# EAGLE schematic double_bellows_configuration (EAGLE 9.6.2)
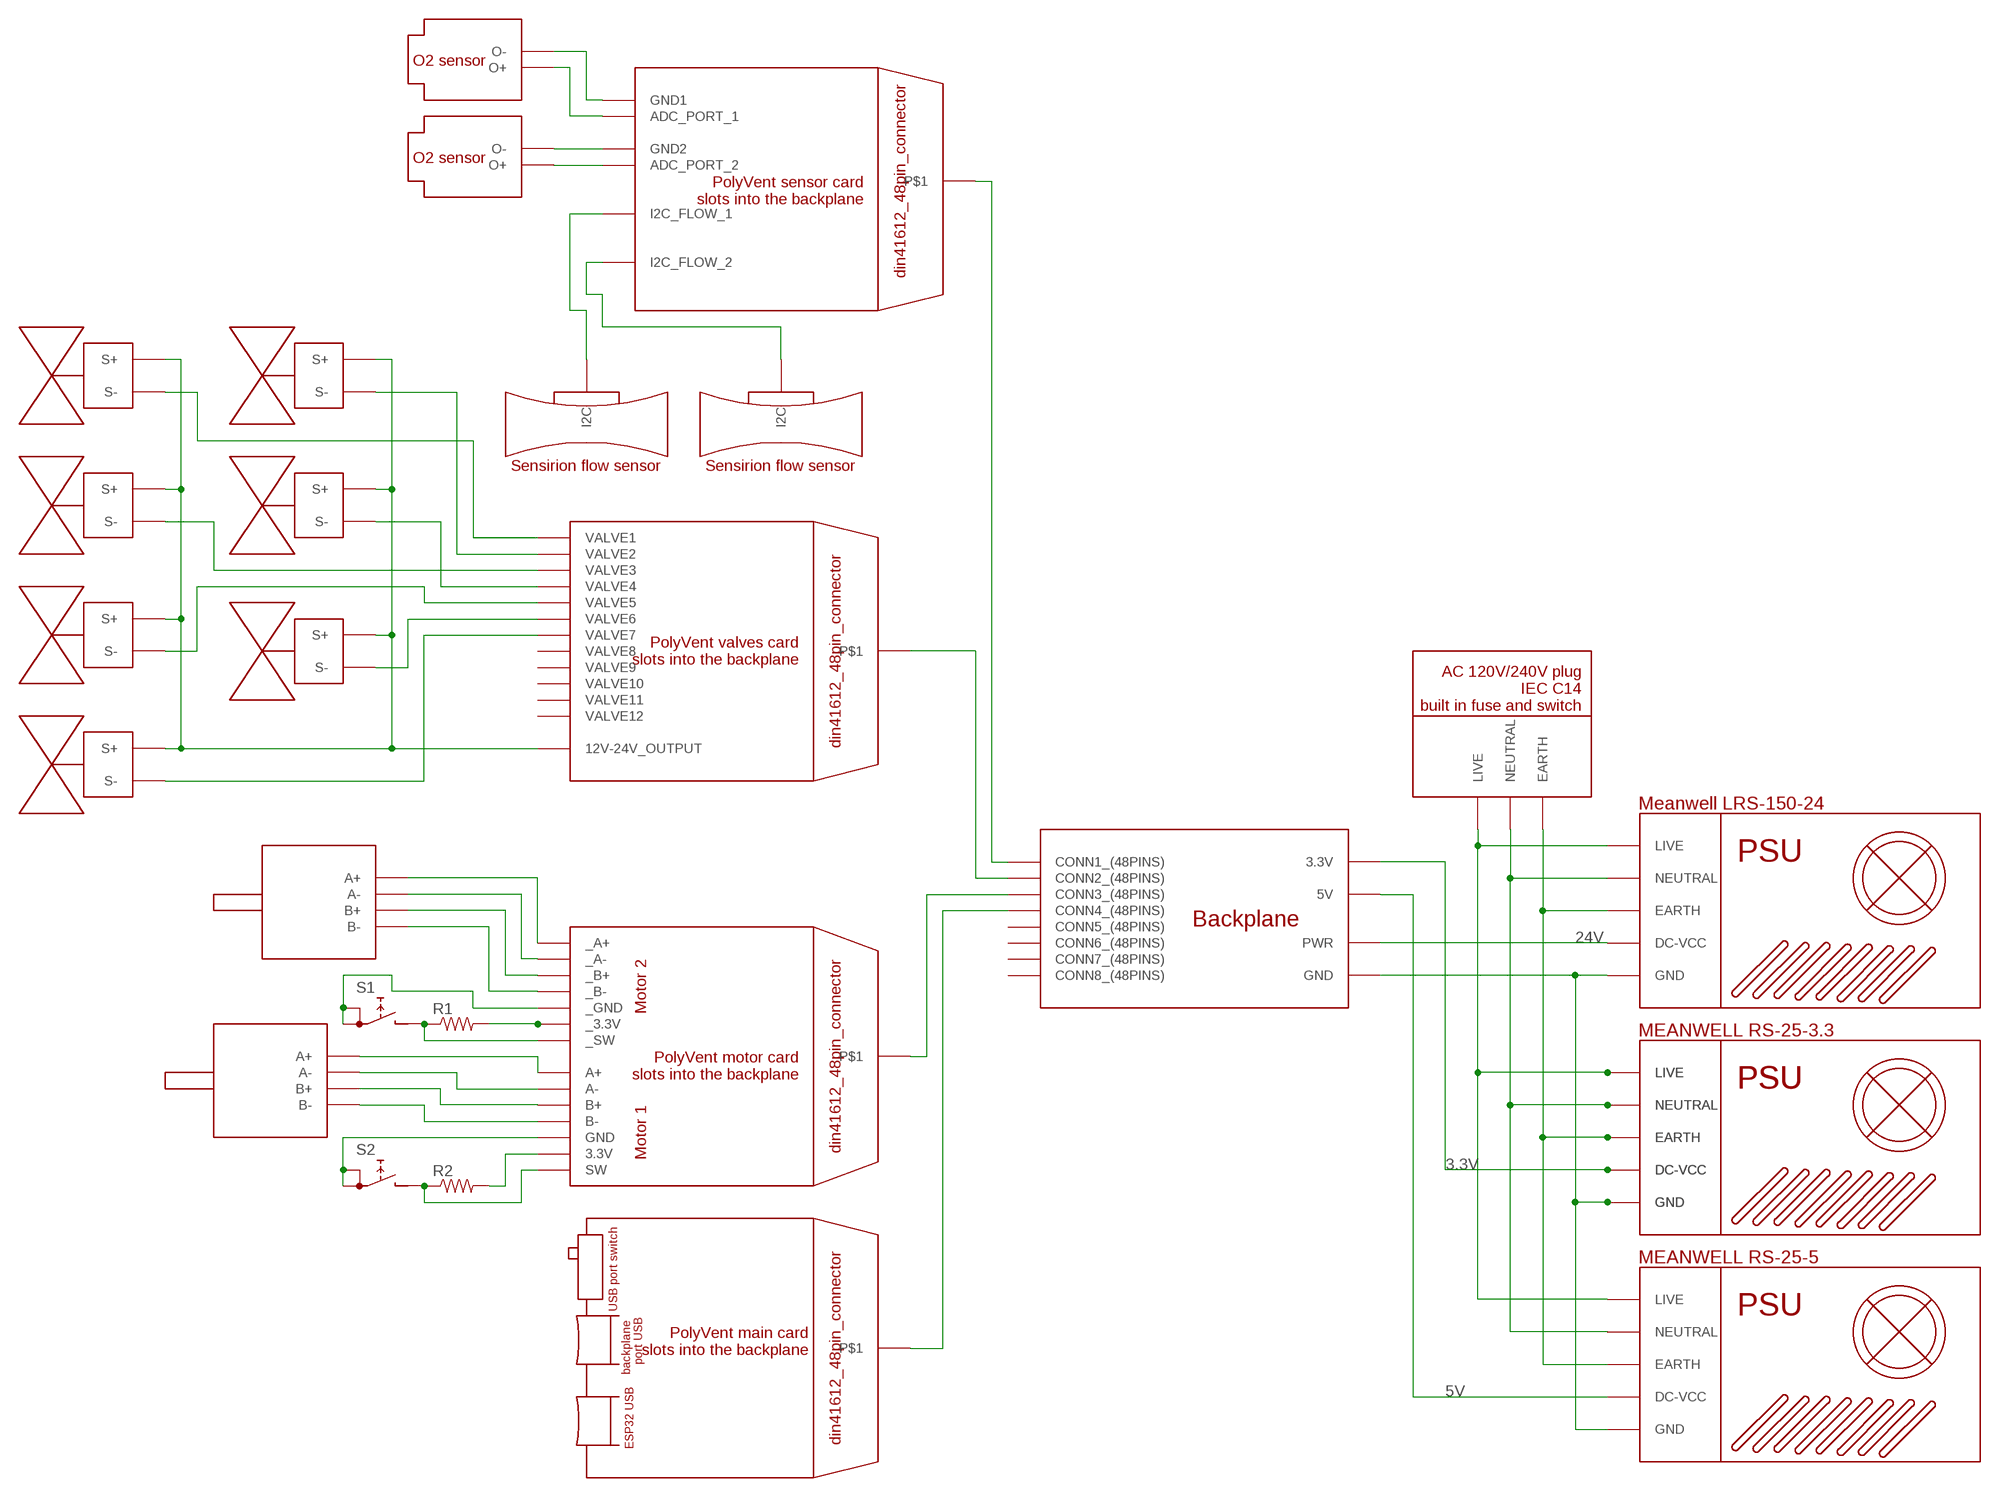
[diagram p0: schematic, sheet 1]

## Parts
R1  RESISTORPTH-1/6W  [1/6W-RES]
R2  RESISTORPTH-1/6W  [1/6W-RES]
S1  RDT1034  [RDT1034]
S2  RDT1034  [RDT1034]
U$1  BACKPLANE  (no package)
U$2  POWER_PLUG_WITH_FUSE_AND_SWITCH  (no package)
U$3  MEANWELL LRS-150-24  PSU  (no package)
U$4  MEANWELL RS-25-3.3  PSU  (no package)
U$5  MEANWELL RS-25-5  PSU  (no package)
U$6  MEANWELL RS-25-3.3  PSU  (no package)
U$7  MOTOR_CARD  (no package)
U$8  VALVES_CARD  (no package)
U$9  SENSOR_CARD  (no package)
U$10  MAIN_CARD  (no package)
U$11  SOLENOID_VALVE  (no package)
U$12  FLOW_SENSOR  (no package)
U$13  STEPPER_MOTOR  (no package)
U$14  OXYGEN_SENSOR  (no package)
U$15  STEPPER_MOTOR  (no package)
U$16  SOLENOID_VALVE  (no package)
U$17  SOLENOID_VALVE  (no package)
U$18  SOLENOID_VALVE  (no package)
U$19  SOLENOID_VALVE  (no package)
U$20  SOLENOID_VALVE  (no package)
U$21  SOLENOID_VALVE  (no package)
U$22  OXYGEN_SENSOR  (no package)
U$23  FLOW_SENSOR  (no package)

## Nets
3.3V: U$1.3.3V U$4.DC-VCC U$6.DC-VCC
5V: U$1.5V U$5.DC-VCC
24V: U$1.PWR U$3.DC-VCC
N$1: U$2.EARTH U$3.EARTH U$4.EARTH U$5.EARTH U$6.EARTH
N$2: U$2.NEUTRAL U$3.NEUTRAL U$4.NEUTRAL U$5.NEUTRAL U$6.NEUTRAL
N$3: U$2.LIVE U$3.LIVE U$4.LIVE U$5.LIVE U$6.LIVE
N$4: U$1.CONN1_(48PINS) U$9.P$1
N$5: U$1.GND U$3.GND U$4.GND U$5.GND U$6.GND
N$6: R1.2 U$1.CONN2_(48PINS) U$7._3.3V U$8.P$1
N$7: U$1.CONN3_(48PINS) U$7.P$1
N$8: U$1.CONN4_(48PINS) U$10.P$1
N$9: R2.2 U$7.3.3V
N$10: R1.1 S1.B U$7._SW
N$11: S1.A S1.A1 U$7._GND
N$12: U$7.B- U$15.B-
N$13: U$7._B- U$13.B-
N$14: U$7._B+ U$13.B+
N$15: U$7._A- U$13.A-
N$16: U$7._A+ U$13.A+
N$17: U$7.B+ U$15.B+
N$18: U$7.A+ U$15.A+
N$19: R2.1 S2.B U$7.SW
N$20: S2.A S2.A1 U$7.GND
N$21: U$7.A- U$15.A-
N$22: U$8.VALVE4 U$19.S-
N$23: U$8.VALVE1 U$11.S-
N$24: U$8.VALVE2 U$18.S-
N$25: U$8.VALVE3 U$16.S-
N$26: U$8.12V-24V_OUTPUT U$11.S+ U$16.S+ U$17.S+ U$18.S+ U$19.S+ U$20.S+ U$21.S+
N$27: U$8.VALVE5 U$17.S-
N$28: U$8.VALVE6 U$20.S-
N$29: U$8.VALVE7 U$21.S-
N$30: U$9.I2C_FLOW_1 U$12.I2C
N$31: U$9.I2C_FLOW_2 U$23.I2C
N$32: U$9.ADC_PORT_2 U$22.O+
N$33: U$9.GND2 U$22.O-
N$34: U$9.GND1 U$14.O-
N$35: U$9.ADC_PORT_1 U$14.O+
Unconnected: U$1.CONN5_(48PINS) U$1.CONN6_(48PINS) U$1.CONN7_(48PINS) U$1.CONN8_(48PINS) U$8.VALVE8 U$8.VALVE9 U$8.VALVE10 U$8.VALVE11 U$8.VALVE12

## Notes on the sheet
- Meanwell LRS-150-24
- MEANWELL RS-25-3.3
- MEANWELL RS-25-5

## Library data of the parts
R1 R2 = SparkFun-Passives:RESISTOR: Resistor Basic schematic elements and footprints for 0603, 1206, and PTH resistors.
S1 S2 = switch:RDT1034: PUSH SWITCH www.radiohm.com
U$1 = polyvent card schematics:BACKPLANE
U$2 = polyvent card schematics:POWER_PLUG_WITH_FUSE_AND_SWITCH
U$3-U$6 = polyvent card schematics:PSU
U$7 = polyvent card schematics:MOTOR_CARD
U$8 = polyvent card schematics:VALVES_CARD
U$9 = polyvent card schematics:SENSOR_CARD
U$10 = polyvent card schematics:MAIN_CARD
U$11 U$16-U$21 = polyvent card schematics:SOLENOID_VALVE
U$12 U$23 = polyvent card schematics:FLOW_SENSOR
U$13 U$15 = polyvent card schematics:STEPPER_MOTOR
U$14 U$22 = polyvent card schematics:OXYGEN_SENSOR

## Net classes
1 POWER: clearance 0.508 mm